# EAGLE design Alfa_m (EAGLE 9.6.2)
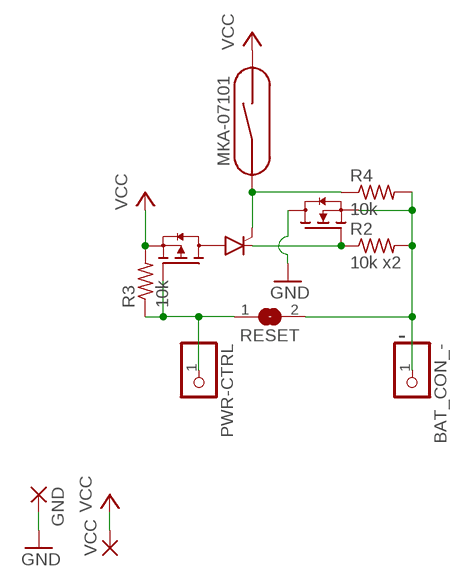
[diagram p0: schematic, sheet 1]

## Parts
AO3407  AO3407A  [SOT23-3]
BAT_CON_-  PINHD-1X1  [1X01]
GND  SMD2  [SMD1,27-2,54]
P0102BL  P0102BL  [SOT23-3]
PWR-CTRL  PINHD-1X1  [1X01]
R2  10k x2  R-US_R0603  [R0603]
R3  10k  R-US_R0603  [R0603]
R4  10k  R-US_R0603  [R0603]
RESET  SJ  [SJ]
SI2302  SI2302CDS  [SOT23-3]
VCC  SMD2  [SMD1,27-2,54]
МКА-07101  МКА-07101  [МКА-07101]

## Nets
GND: GND.1(P) SI2302.3(D)
N$5: P0102BL.1(C) R2.1 SI2302.1(G)
N$6: P0102BL.2(G) R4.1 МКА-07101.1
N$7: AO3407.3(D) P0102BL.3(A)
N$8: BAT_CON_-.1 R2.2 R4.2 RESET.2 SI2302.2(S)
N$9: AO3407.1(G) PWR-CTRL.1 R3.1 RESET.1
VCC: AO3407.2(S) R3.2 VCC.1(P) МКА-07101.2

## Notes on the sheet
- -

## Library data of the parts
AO3407 = CanCubeSat:AO3407A
BAT_CON_- PWR-CTRL = pinhead:PINHD-1X1: PIN HEADER
GND VCC = wirepad:SMD2: SMD PAD
P0102BL = Kunosheru:P0102BL
R2-R4 = rcl:R-US_: RESISTOR, American symbol; SPICEPREFIX: R
RESET = jumper:SJ: SMD solder JUMPER
SI2302 = CanCubeSat:SI2302CDS
МКА-07101 = Kunosheru:МКА-07101

## Board
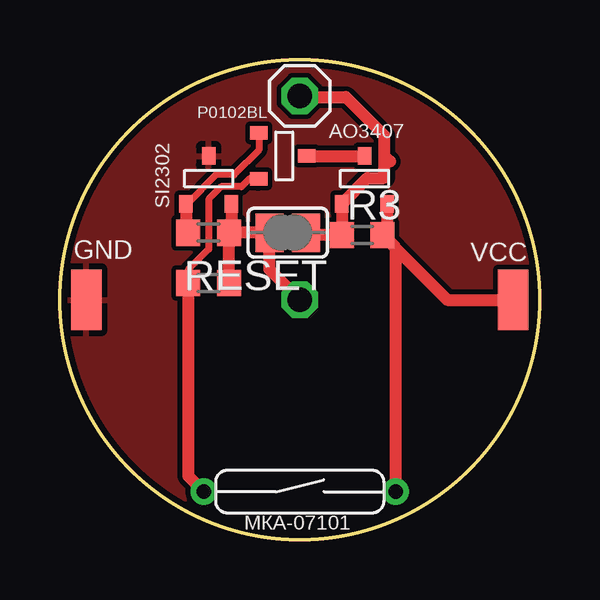
[diagram p1: board, top side]
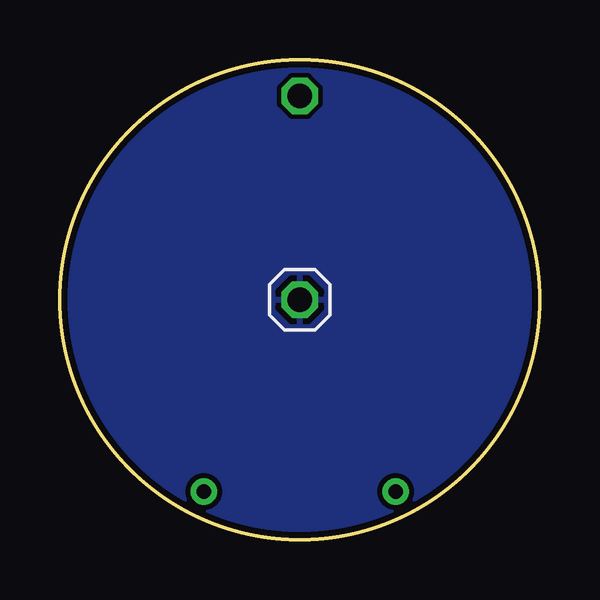
[diagram p2: board, bottom side, seen from below]

Size 20 x 20 mm. Coordinates in mm from the lower left corner, seen from the top.
Outline: circle at 10,10 radius 10
Copper layers (1*16): Top 0.035mm / dielectric 1.5mm / Bottom 0.035mm
Design rules "rezonit": minimum track width 0.25mm, minimum drill 0.35mm, track to track 0.2mm, track to pad 0.2mm, pad to pad 0.15mm, via to via 0.2mm, smd to smd 0.2mm, copper to edge 0.25mm, drill to drill 0.25mm, minimum pad ring 10mil, minimum via ring 8mil, stop-mask expansion 4mil, vias tented up to drill 0mil, thermal gap 10mil

### Footprints (pad centres in the part's own frame; a part is rotated, then mirrored left to right if it is on the bottom)
SOT23-3 = smd 0.56 x 0.73: 1 -0.95,-1; 2 0.95,-1; 3 0,1
1X01 = drill 1.016 octagon: 1 0,0
SMD1,27-2,54 = smd 1.27 x 2.54: 1 0,0
R0603 = smd 1 x 1.1: 1 -0.85,0; 2 0.85,0
SJ = smd 1.168 x 1.6: 1 -0.762,0; 2 0.762,0
МКА-07101 = drill 0.6: 1 -4,0; 2 4,0

### Placement (x,y rotation side)
AO3407  12.7,15 0 top
BAT_CON_-  10,10 0 bottom
GND  1.1,10 0 top
P0102BL  9.3,16 270 top
PWR-CTRL  10,18.5 0 top
R2  6.2,12.8 0 top
R3  12.6,12.7 0 top
R4  6.2,10.7 0 top
RESET  9.5,12.8 180 top
SI2302  6.2,15 0 top
VCC  18.9,10 0 top
МКА-07101  10,2 0 top

### Tracks (layer width: path | path; a pad name or v marks a point on that pad's centre or on a via)
GND
  pour Top: 0,0 0,21 21,21 21,0
N$5
  Top 0.3: P0102BL.1 8.3,16.25 7.26,15.21 6.52,15.21 5.3,14 SI2302.1
  Top 0.5: SI2302.1 5.25,12.9 R2.1
N$6
  Top 0.3: P0102BL.2 7.9,15.05 7.57,14.71 6.72,14.71 6.2,14.19 6.2,12.11 5.35,11.26 R4.1
  Top 0.5: P0102BL.2 8.25,15 | R4.1 5.35,2.65 МКА-07101.1
N$7
  Top 0.5: P0102BL.3 AO3407.3
N$8
  Top 0.5: R4.2 R2.2 | R2.2 7.08,12.82 | SI2302.2 7.15,12.9 | 7.15,12.9 R2.2 | 7.15,12.9 7.25,12.8 RESET.2 8.74,11.26 BAT_CON_-.1
  pour Bottom: 0,0 0,20 20,20 20,0
N$9
  Top 0.5: PWR-CTRL.1 10.05,18.45 11.93,18.45 13.53,16.85 13.53,16 | 13.53,16 13.53,15.1 13.5,15.07 12.82,15.07 AO3407.1 R3.1 10.36,12.7 RESET.1 | 13.76,15.76 13.53,16
VCC
  Top 0.3: 13.72,13.95 AO3407.2 | 18.9,9.9 VCC.1 18.9,10.03
  Top 0.5: 18.6,9.9 18.9,9.9 18.8,10 16.15,10 R3.2 | R3.2 13.65,12.9 AO3407.2 | МКА-07101.2 14,12.15 R3.2

### Text on the board
tValues: Middle board / This side up / By ATLAS++ / Korolyov, / TSNIIMASH